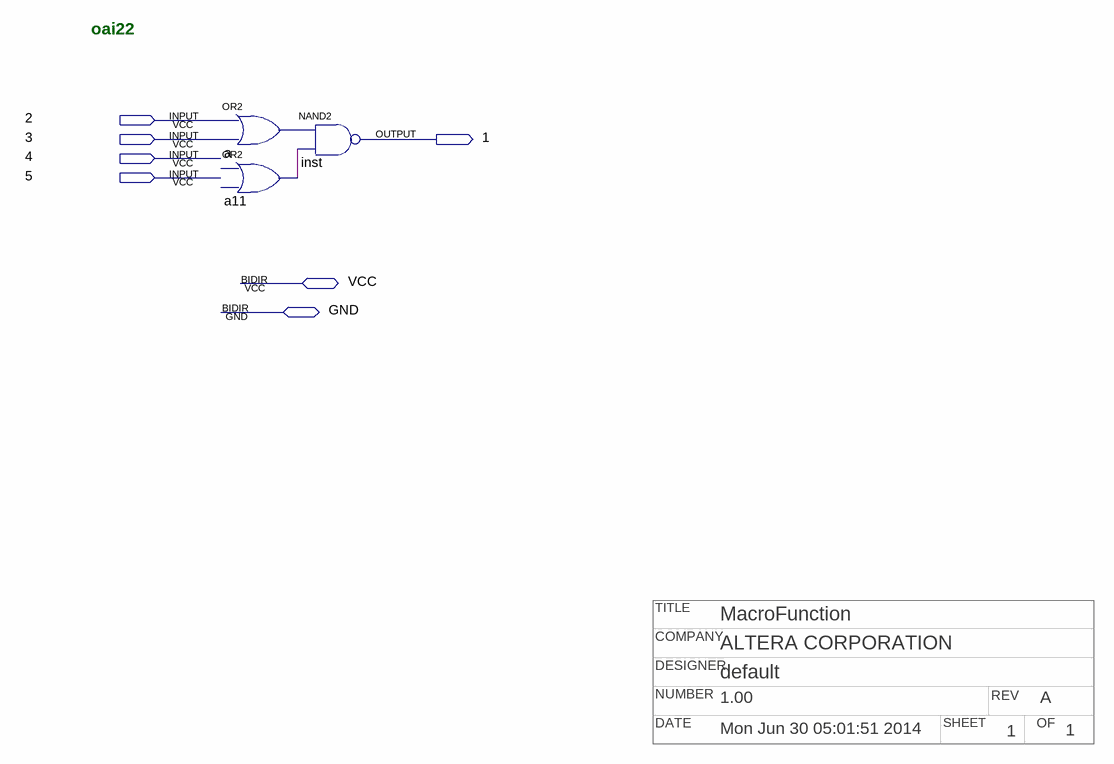
[diagram p0: schematic sheet]
// Quartus schematic npoai22.bdf as structural Verilog: 3 symbols, 7 pins
// Title block: TITLE: MacroFunction; COMPANY: ALTERA CORPORATION; DESIGNER: default; NUMBER: 1.00; REV: A; DATE: Mon Jun 30 05:01:51 2014; SHEET: 1; OF: 1
module npoai22 (
  input  \2 ,
  input  \3 ,
  input  \4 ,
  input  \5 ,
  inout  VCC,
  inout  GND,
  output \1 
);

  wire a11_out, a_out;

  or a (a_out, \2 , \3 );
  // OR2 a11 has open pins: IN1=open, IN2=open, OUT=a11_out
  nand inst (\1 , a_out, a11_out);

  // Notes on the sheet:
  //   oai22
endmodule
